# Altium schematic sheet Peripheral.SchDoc
size A4
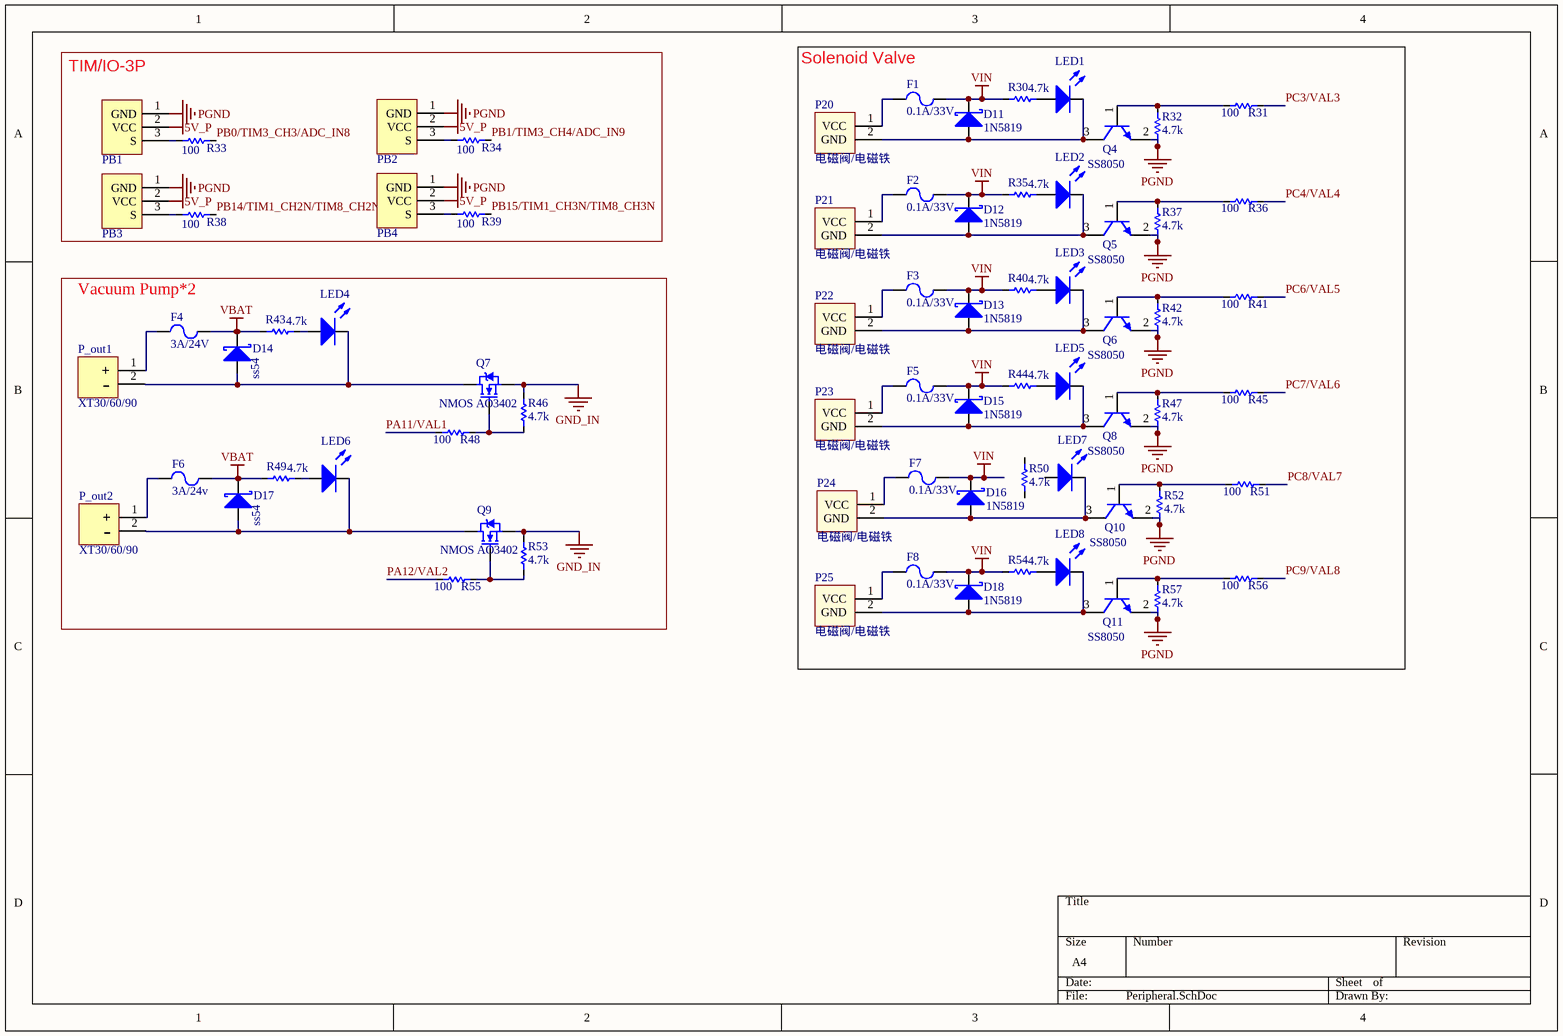
[diagram p0: Peripheral.SchDoc]

## Parts
D11  1N5819  [SOD-323-]
D12  1N5819  [SOD-323-]
D13  1N5819  [SOD-323-]
D14  ss54  [SMAF/DO-214AC]
D15  1N5819  [SOD-323-]
D16  1N5819  [SOD-323-]
D17  ss54  [SMAF/DO-214AC]
D18  1N5819  [SOD-323-]
F1  0.1A/33V  [0603C]
F2  0.1A/33V  [0603C]
F3  0.1A/33V  [0603C]
F4  3A/24V  [0603C]
F5  0.1A/33V  [0603C]
F6  3A/24v  [0603C]
F7  0.1A/33V  [0603C]
F8  0.1A/33V  [0603C]
LED1  LED_RED  [0603LED_B]  (value not drawn)
LED2  LED_RED  [0603LED_B]  (value not drawn)
LED3  LED_RED  [0603LED_B]  (value not drawn)
LED4  LED_RED  [0603LED_B]  (value not drawn)
LED5  LED_RED  [0603LED_B]  (value not drawn)
LED6  LED_RED  [0603LED_B]  (value not drawn)
LED7  LED_RED  [0603LED_B]  (value not drawn)
LED8  LED_RED  [0603LED_B]  (value not drawn)
P20  电磁阀/电磁铁  [HY2.00MM 2X1_立式]
P21  电磁阀/电磁铁  [HY2.00MM 2X1_立式]
P22  电磁阀/电磁铁  [HY2.00MM 2X1_立式]
P23  电磁阀/电磁铁  [HY2.00MM 2X1_立式]
P24  电磁阀/电磁铁  [HY2.00MM 2X1_立式]
P25  电磁阀/电磁铁  [HY2.00MM 2X1_立式]
P_out1  XT30/60/90  [XT30UPB-FEMALE]
P_out2  XT30/60/90  [XT30UPB-FEMALE]
PB1  3Pin_IO  [HY2.00MM 3x1立式]  (value not drawn)
PB2  3Pin_IO  [HY2.00MM 3x1立式]  (value not drawn)
PB3  3Pin_IO  [HY2.00MM 3x1立式]  (value not drawn)
PB4  3Pin_IO  [HY2.00MM 3x1立式]  (value not drawn)
Q4  SS8050  [SOT-23-3]
Q5  SS8050  [SOT-23-3]
Q6  SS8050  [SOT-23-3]
Q7  NMOS AO3402  [SOT-23-3]
Q8  SS8050  [SOT-23-3]
Q9  NMOS AO3402  [SOT-23-3]
Q10  SS8050  [SOT-23-3]
Q11  SS8050  [SOT-23-3]
R30  4.7k  [0603R]
R31  100  [0603R]
R32  4.7k  [0603R]
R33  100  [0603R]
R34  100  [0603R]
R35  4.7k  [0603R]
R36  100  [0603R]
R37  4.7k  [0603R]
R38  100  [0603R]
R39  100  [0603R]
R40  4.7k  [0603R]
R41  100  [0603R]
R42  4.7k  [0603R]
R43  4.7k  [0603R]
R44  4.7k  [0603R]
R45  100  [0603R]
R46  4.7k  [0603R]
R47  4.7k  [0603R]
R48  100  [0603R]
R49  4.7k  [0603R]
R50  4.7k  [0603R]
R51  100  [0603R]
R52  4.7k  [0603R]
R53  4.7k  [0603R]
R54  4.7k  [0603R]
R55  100  [0603R]
R56  100  [0603R]
R57  4.7k  [0603R]

## Blocks framed on the sheet
TIM/IO-3P: PB1-PB4 R33 R34 R38 R39
Solenoid Valve: D11-D13 D15 D16 D18 F1-F3 F5 F7 F8 LED1-LED3 LED5 LED7 LED8 P20-P25 Q4-Q6 Q8 Q10 Q11 R30-R32 R35-R37 R40-R42 R44 R45 R47 R50-R52 R54 R56 R57
Vacuum Pump*2: D14 D17 F4 F6 LED4 LED6 P_out1 P_out2 Q7 Q9 R43 R46 R48 R49 R53 R55

## Nets
5V_P: PB1.2(VCC) PB2.2(VCC) PB3.2(VCC) PB4.2(VCC)
GND_IN: Q7.2(S) Q9.2(S) R46.2 R53.2
PGND: PB1.1(GND) PB2.1(GND) PB3.1(GND) PB4.1(GND) Q4.2(E) Q5.2(E) Q6.2(E) Q8.2(E) Q10.2(E) Q11.2(E) R32.1 R37.1 R42.1 R47.1 R52.1 R57.1
VBAT: D14.2 D17.2 F4.2 F6.2 R43.1 R49.1
VIN: D11.2 D12.2 D13.2 D15.2 D16.2 D18.2 F1.2 F2.2 F3.2 F5.2 F7.2 F8.2 R30.1 R35.1 R40.1 R44.1 R54.1
PA11/VAL1: R48.1
PA12/VAL2: R55.1
PB0/TIM3_CH3/ADC_IN8: R33.2
PB1/TIM3_CH4/ADC_IN9: R34.2
PB14/TIM1_CH2N/TIM8_CH2N: R38.2
PB15/TIM1_CH3N/TIM8_CH3N: R39.2
PC3/VAL3: R31.2
PC4/VAL4: R36.2
PC6/VAL5: R41.2
PC7/VAL6: R45.2
PC8/VAL7: R51.2
PC9/VAL8: R56.2
NetD11_1: D11.1 LED1.2 P20.2(GND) Q4.3(C)
NetD12_1: D12.1 LED2.2 P21.2(GND) Q5.3(C)
NetD13_1: D13.1 LED3.2 P22.2(GND) Q6.3(C)
NetD14_1: D14.1 LED4.2 P_out1.2(-) Q7.3(D)
NetD15_1: D15.1 LED5.2 P23.2(GND) Q8.3(C)
NetD16_1: D16.1 LED7.2 P24.2(GND) Q10.3(C)
NetD17_1: D17.1 LED6.2 P_out2.2(-) Q9.3(D)
NetD18_1: D18.1 LED8.2 P25.2(GND) Q11.3(C)
NetF1_1: F1.1 P20.1(VCC)
NetF2_1: F2.1 P21.1(VCC)
NetF3_1: F3.1 P22.1(VCC)
NetF4_1: F4.1 P_out1.1(+)
NetF5_1: F5.1 P23.1(VCC)
NetF6_1: F6.1 P_out2.1(+)
NetF7_1: F7.1 P24.1(VCC)
NetF8_1: F8.1 P25.1(VCC)
NetLED1_1: LED1.1 R30.2
NetLED2_1: LED2.1 R35.2
NetLED3_1: LED3.1 R40.2
NetLED4_1: LED4.1 R43.2
NetLED5_1: LED5.1 R44.2
NetLED6_1: LED6.1 R49.2
NetLED8_1: LED8.1 R54.2
NetPB1_3: PB1.3(S) R33.1
NetPB2_3: PB2.3(S) R34.1
NetPB3_3: PB3.3(S) R38.1
NetPB4_3: PB4.3(S) R39.1
NetQ4_1: Q4.1(B) R31.1 R32.2
NetQ5_1: Q5.1(B) R36.1 R37.2
NetQ6_1: Q6.1(B) R41.1 R42.2
NetQ7_1: Q7.1(G) R46.1 R48.2
NetQ8_1: Q8.1(B) R45.1 R47.2
NetQ9_1: Q9.1(G) R53.1 R55.2
NetQ10_1: Q10.1(B) R51.1 R52.2
NetQ11_1: Q11.1(B) R56.1 R57.2

Not connected (* = marked no-connect by the designer): LED7 1; R50 1 2

## Library data of the parts
D11-D13 D15 D16 D18 = D Schottky: Schottky Diode; Published: 8-Jun-2000; LatestRevisionDate: 17-Jul-2002; LatestRevisionNote: Re-released for DXP Platform.; PackageReference: SMB; Publisher: Altium Limited; PackageDescription: DO-214-AA/SMB; 2 C-Bend Leads; Body 5.3 x 3.6 mm, inc. leads (LxW); Code_JEDEC: DO-214-AA
D14 D17 = D Schottky_SOD323: Schottky Diode; Published: 8-Jun-2000; LatestRevisionDate: 17-Jul-2002; LatestRevisionNote: Re-released for DXP Platform.; PackageReference: SMB; Publisher: Altium Limited; PackageDescription: DO-214-AA/SMB; 2 C-Bend Leads; Body 5.3 x 3.6 mm, inc. leads (LxW); Code_JEDEC: DO-214-AA
F1-F8 = Finance: 0603自恢复保险丝
LED1-LED8 = LED: Typical RED, GREEN, YELLOW, AMBER GaAs LED; Published: 8-Jun-2000; LatestRevisionDate: 17-Jul-2002; LatestRevisionNote: Re-released for DXP Platform.; PackageVersion: Feb-2002; PackageReference: 3.2X1.6X1.1; Publisher: Altium Limited; PackageDescription: SM LED; 2 Flat Leads
PB1-PB4 = 3Pin_IO: 3pin input/output. V+S+G
Q4-Q6 Q8 Q10 Q11 = NPN: NPN Bipolar Transistor; Published: 8-Jun-2000; LatestRevisionDate: 17-Jul-2002; LatestRevisionNote: Re-released for DXP Platform.; PackageReference: TO-226-AA; Publisher: Altium Limited; PackageDescription: TO, Flat Index; 3 In-Line, Axial Leads; Body Dia. 4.8mm; Leads 0.55 x 0.51 mm (max); Code_JEDEC: TO-226-AA
Q7 Q9 = NMOS(SOT23): N-Channel Power MOSFET; Note: Pin 2 is electrically connected to pin 4.; Published: 8-Jun-2000; LatestRevisionDate: 17-Jul-2002; LatestRevisionNote: Re-released for DXP Platform.; DatasheetVersion: PD-9.814; PackageVersion: Feb-1997; PackageReference: TO-220AB; Publisher: Altium Limited; PackageDescription: TO, Thru-Hole, Vertical, Heatsink Mounted; 3 In-Line Leads; Pitch 2.54 mm; ComponentLink1Description: Manufacturer Link; ComponentLink1URL: http://www.irf.com/
R30 R31 R33-R36 R38-R41 R43-R45 R48-R51 R54-R56 = Res1: Resistor; Value: 1K; Published: 8-Jun-2000; LatestRevisionDate: 17-Jul-2002; LatestRevisionNote: Re-released for DXP Platform.; PackageReference: AXIAL-0.3; Publisher: Altium Limited; PackageDescription: Axial Device, Thru-Hole; 2 Leads; 0.3 in Pin Spacing
R32 R37 R42 R46 R47 R52 R53 R57 = Res1: Resistor; Published: 8-Jun-2000; LatestRevisionDate: 17-Jul-2002; LatestRevisionNote: Re-released for DXP Platform.; PackageReference: AXIAL-0.3; Publisher: Altium Limited; PackageDescription: Axial Device, Thru-Hole; 2 Leads; 0.3 in Pin Spacing; Value: 4.7k